# Altium schematic sheet CH340K6T-R0.SchDoc
size 139 x 139 mm; SheetNumber: 0; SheetTotal: 0
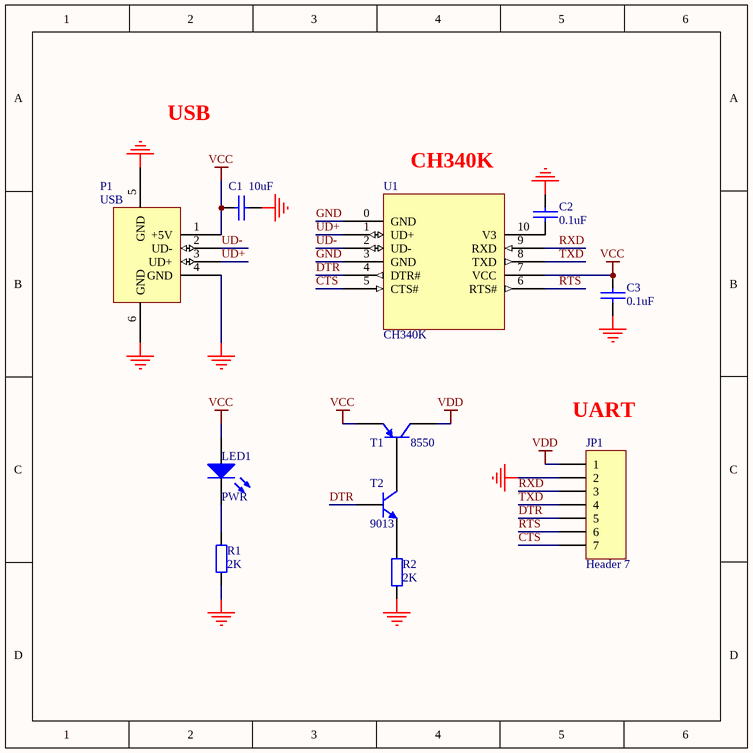
[diagram p0: CH340K6T-R0.SchDoc]

## Parts
C1  10uF  [3216_C]
C2  0.1uF  [0603_C]
C3  0.1uF  [0603_C]
JP1  Header 7  [SIP7-2.54mm]
LED1  PWR  [0603+]
P1  USB  [USBAM]
R1  2K  [0603]
R2  2K  [0603]
T1  8550  [SOT-23]
T2  9013  [SOT-23]
U1  CH340K  [ESSOP10]

## Nets
GND: C1.2 C2.2 C3.1 JP1.2 P1.4(GND) P1.5(GND) P1.6(GND) R1.2 R2.1 U1.0(GND) U1.3(GND)
VCC: C1.1 C3.2 LED1.1(A) P1.1(+5V) T1.2(E) U1.7(VCC)
VDD: JP1.1 T1.3(C)
CTS: JP1.7 U1.5(CTS#)
DTR: JP1.5 T2.1(B) U1.4(DTR#)
RTS: JP1.6 U1.6(RTS#)
RXD: JP1.3 U1.9(RXD)
TXD: JP1.4 U1.8(TXD)
UD+: P1.3(UD+) U1.1(UD+)
UD-: P1.2(UD-) U1.2(UD-)
NetC2_1: C2.1 U1.10(V3)
NetLED1_2: LED1.2(K) R1.1
NetR2_2: R2.2 T2.2(E)
NetT1_1: T1.1(B) T2.3(C)

## Notes on the sheet
- USB
- (near U1) CH340K
- (near JP1) UART

## Library data of the parts
C1-C3 = CAP: Capacitor
JP1 = Header 7: Header, 7-Pin; LatestRevisionDate: 17-Jul-2002; LatestRevisionNote: Re-released for DXP Platform.; Publisher: Altium Limited
LED1 = LED2: Typical RED, GREEN, YELLOW, AMBER GaAs LED
R1 R2 = Res2: Resistor
T1 = PNP: PNP Bipolar Transistor
T2 = NPN: NPN Bipolar Transistor
U1 = CH340K: USB to TTL Serial / UART for dual power